# EAGLE design FX3_Explorer_Breakout_RevC (EAGLE 8.3.1)
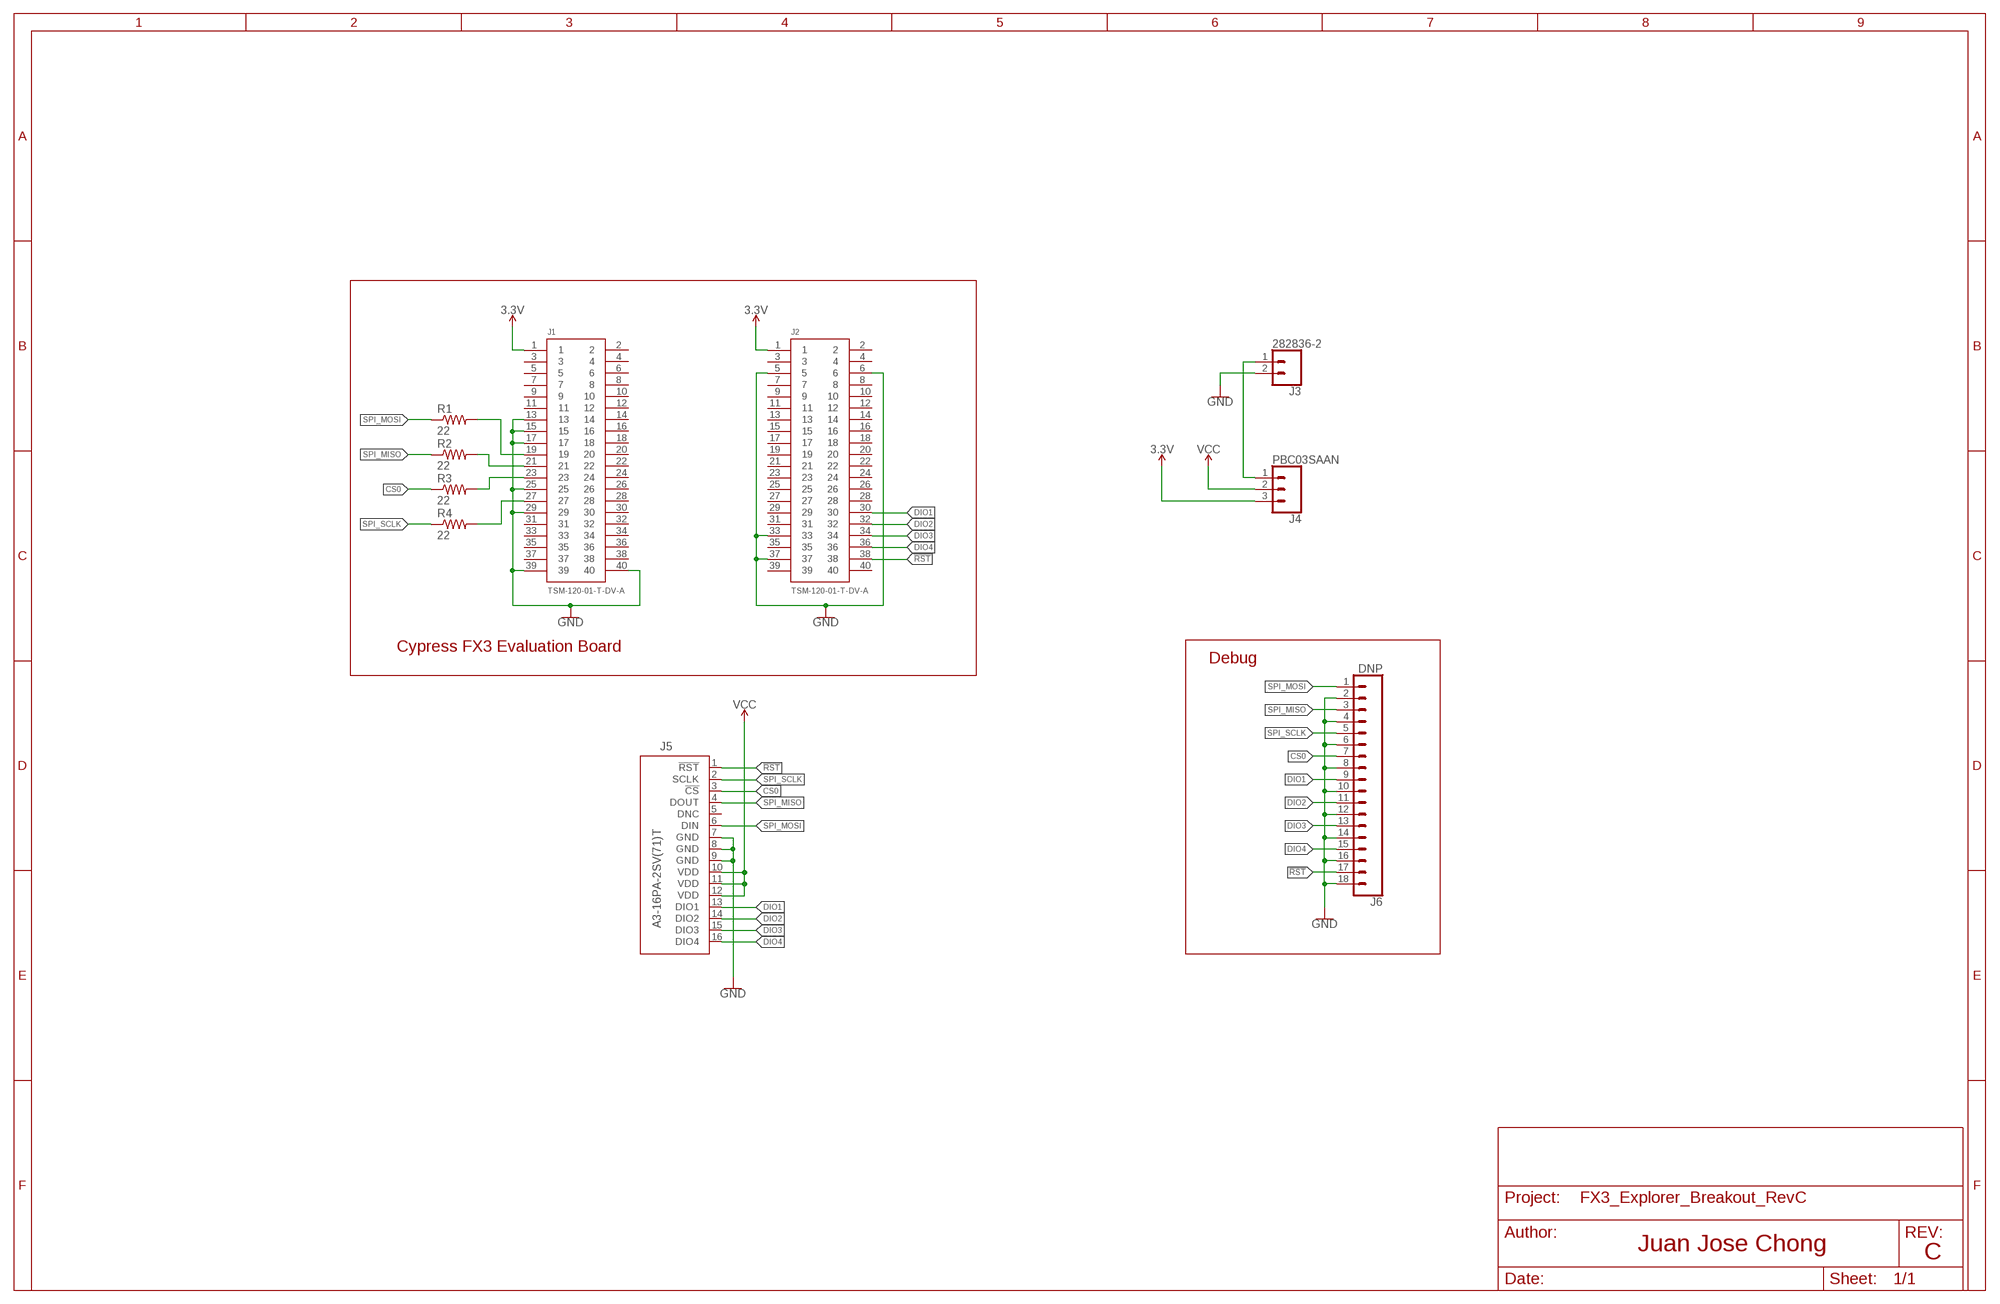
[diagram p0: schematic, sheet 1]

## Parts
J1  TSM-120-01-T-DV-A  TSM-120-XX-XXX-DV  [TSM-120-XX-XXX-D]
J2  TSM-120-01-T-DV-A  TSM-120-XX-XXX-DV  [TSM-120-XX-XXX-D]
J3  282836-2  CONN_025MM  [SCREWTERMINAL-5MM-2]
J4  PBC03SAAN  CONN_03  [1X03]
J5  A3-16PA-2SV(71)T  [A3-16PA-2SV(71)-TOP]
J6  DNP  CONN_18SILK  [1X18]
R1  22  R-US_R0603  [R0603]
R2  22  R-US_R0603  [R0603]
R3  22  R-US_R0603  [R0603]
R4  22  R-US_R0603  [R0603]

## Nets
3.3V: J1.1 J2.1 J4.3
!RST: J2.38 J5.1(!RST) J6.17
CS0: J5.3(!CS) J6.7 R3.1
DIO1: J2.30 J5.13(DIO1) J6.9
DIO2: J2.32 J5.14(DIO2) J6.11
DIO3: J2.34 J5.15(DIO3) J6.13
DIO4: J2.36 J5.16(DIO4) J6.15
GND: J1.13 J1.15 J1.17 J1.25 J1.29 J1.39 J1.40 J2.5 J2.6 J2.33 J2.37 J3.2 J5.7(GND) J5.8(GND) J5.9(GND) J6.2 J6.4 J6.6 J6.8 J6.10 J6.12 J6.14 J6.16 J6.18
N$1: J1.19 R1.2
N$2: J1.21 R2.2
N$3: J1.23 R3.2
N$4: J1.27 R4.2
N$6: J3.1 J4.1
SPI_MISO: J5.4(DOUT) J6.3 R2.1
SPI_MOSI: J5.6(DIN) J6.1 R1.1
SPI_SCLK: J5.2(SCLK) J6.5 R4.1
VCC: J4.2 J5.10(VDD) J5.11(VDD) J5.12(VDD)
Unconnected: J1.2 J1.3 J1.4 J1.5 J1.6 J1.7 J1.8 J1.9 J1.10 J1.11 J1.12 J1.14 J1.16 J1.18 J1.20 J1.22 J1.24 J1.26 J1.28 J1.30 J1.31 J1.32 J1.33 J1.34 J1.35 J1.36 J1.37 J1.38 J2.2 J2.3 J2.4 J2.7 J2.8 J2.9 J2.10 J2.11 J2.12 J2.13 J2.14 J2.15 J2.16 J2.17 J2.18 J2.19 J2.20 J2.21 J2.22 J2.23 J2.24 J2.25 J2.26 J2.27 J2.28 J2.29 J2.31 J2.35 J2.39 J2.40 J5.5(DNC)

## Notes on the sheet
- Cypress FX3 Evaluation Board
- Debug
- C

## Library data of the parts
J1 J2 = TSM-120-XX-XXX-DV:TSM-120-XX-XXX-DV: .100" (2,54mm) Surface Mount, Double Row, Vertical Mount. manufacturer:SAMTEC; PARTNO: TSM-120-01-T-DV-A
J3 = SparkFun-Connectors:CONN_02: Multi connection point. Often used as Generic Header-pin footprint for 0.1 inch spaced/style header connections On any of the 0.1 inch spaced packages, you can populate with these: Break Away Headers - Straight <https://www.sparkfun.com/products/116> (PRT-00116) Break Away Male Headers - Right Angle <https://www.sparkfun.com/products/553> (PRT-00553) Female Headers <https://www.sparkfun.com/products/115> (PRT-00115) Break Away Headers - Machine Pin <https://www.sparkfun.com/products/117> (PRT-00117) Break Away Female Headers - Swiss Machine Pin <https://www.sparkfun.com/products/743> (PRT-00743) For SCREWTERMINALS and SPRING TERMINALS visit here: Screw Terimnals on SparkFun.com <https://www.sparkfun.com/search/results?term=Screw+Terminals> (5mm/3.5mm/2.54mm spacing) This device is also useful as a general connection point to wire up your design to another part of your project. Our various solder wires solder well into these plated through hole pads. Hook-Up Wire - Assortment (Stranded, 22 AWG) <https://www.sparkfun.com/products/11375> (PRT-11375) Hook-Up Wire - Assortment (Solid Core, 22 AWG) <https://www.sparkfun.com/products/11367> (PRT-11367) View the entire wire category on our website here <https://www.sparkfun.com/categories/141> Special notes: Molex polarized connector foot print use with: PRT-08233 with associated crimp pins and housings. 2.54_SCREWTERM for use with PRT-10571. 3.5mm Screw Terminal footprints for PRT-08084 5mm Screw Terminal footprints for use with PRT-08432; PARTNO: 282836-2; SF_SKU: PRT-08432
J4 = SparkFun-Connectors:CONN_03: Multi connection point. Often used as Generic Header-pin footprint for 0.1 inch spaced/style header connections On any of the 0.1 inch spaced packages, you can populate with these: Break Away Headers - Straight <https://www.sparkfun.com/products/116> (PRT-00116) Break Away Male Headers - Right Angle <https://www.sparkfun.com/products/553> (PRT-00553) Female Headers <https://www.sparkfun.com/products/115> (PRT-00115) Break Away Headers - Machine Pin <https://www.sparkfun.com/products/117> (PRT-00117) Break Away Female Headers - Swiss Machine Pin <https://www.sparkfun.com/products/743> (PRT-00743) Stackable Header - 3 Pin (Female, 0.1") <https://www.sparkfun.com/products/13875> (PRT-13875) For SCREWTERMINALS and SPRING TERMINALS visit here: Screw Terimnals on SparkFun.com <https://www.sparkfun.com/search/results?term=Screw+Terminals> (5mm/3.5mm/2.54mm spacing) This device is also useful as a general connection point to wire up your design to another part of your project. Our various solder wires solder well into these plated through hole pads. Hook-Up Wire - Assortment (Stranded, 22 AWG) <https://www.sparkfun.com/products/11375> (PRT-11375) Hook-Up Wire - Assortment (Solid Core, 22 AWG) <https://www.sparkfun.com/products/11367> (PRT-11367) View the entire wire category on our website here <https://www.sparkfun.com/categories/141> Special notes: Molex polarized connector foot print use with SKU : PRT-08232 with associated crimp pins and housings.; PARTNO: PBC03SAAN
J5 = Analog Devices iSensors:A3-16PA-2SV(71); PARTNO: A3-16PA-2SV(71)
J6 = SparkFun-Connectors:CONN_18: Multi connection point. Often used as Generic Header-pin footprint for 0.1 inch spaced/style header connections On any of the 0.1 inch spaced packages, you can populate with these: Break Away Headers - Straight <https://www.sparkfun.com/products/116> (PRT-00116) Break Away Male Headers - Right Angle <https://www.sparkfun.com/products/553> (PRT-00553) Female Headers <https://www.sparkfun.com/products/115> (PRT-00115) Break Away Headers - Machine Pin <https://www.sparkfun.com/products/117> (PRT-00117) Break Away Female Headers - Swiss Machine Pin <https://www.sparkfun.com/products/743> (PRT-00743) For SCREWTERMINALS and SPRING TERMINALS visit here: Screw Terimnals on SparkFun.com <https://www.sparkfun.com/search/results?term=Screw+Terminals> (5mm/3.5mm/2.54mm spacing) This device is also useful as a general connection point to wire up your design to another part of your project. Our various solder wires solder well into these plated through hole pads. Hook-Up Wire - Assortment (Stranded, 22 AWG) <https://www.sparkfun.com/products/11375> (PRT-11375) Hook-Up Wire - Assortment (Solid Core, 22 AWG) <https://www.sparkfun.com/products/11367> (PRT-11367) View the entire wire category on our website here <https://www.sparkfun.com/categories/141> Special notes: Molex polarized connector foot print use with SKU : PRT-08231 with associated crimp pins and housings. 1MM SMD Version SKU: PRT-10208 NOTES ON THE VARIANTS LOCK and LOCK_LONGPADS... This footprint was designed to help hold the alignment of a through-hole component (i.e. 6-pin header) while soldering it into place. You may notice that each hole has been shifted either up or down by 0.005 of an inch from it's more standard position (which is a perfectly straight line). This slight alteration caused the pins (the squares in the middle) to touch the edges of the holes. Because they are alternating, it causes a "brace" to hold the component in place. 0.005 has proven to be the perfect amount of "off-center" position when using our standard breakaway headers. Although looks a little odd when you look at the bare footprint, once you have a header in there, the alteration is very hard to notice. Also,if you push a header all the way into place, it is covered up entirely on the bottom side.
R1-R4 = adafruit:R-US_: RESISTOR, American symbol; PARTNO: RC0603FR-0722RL

## Board
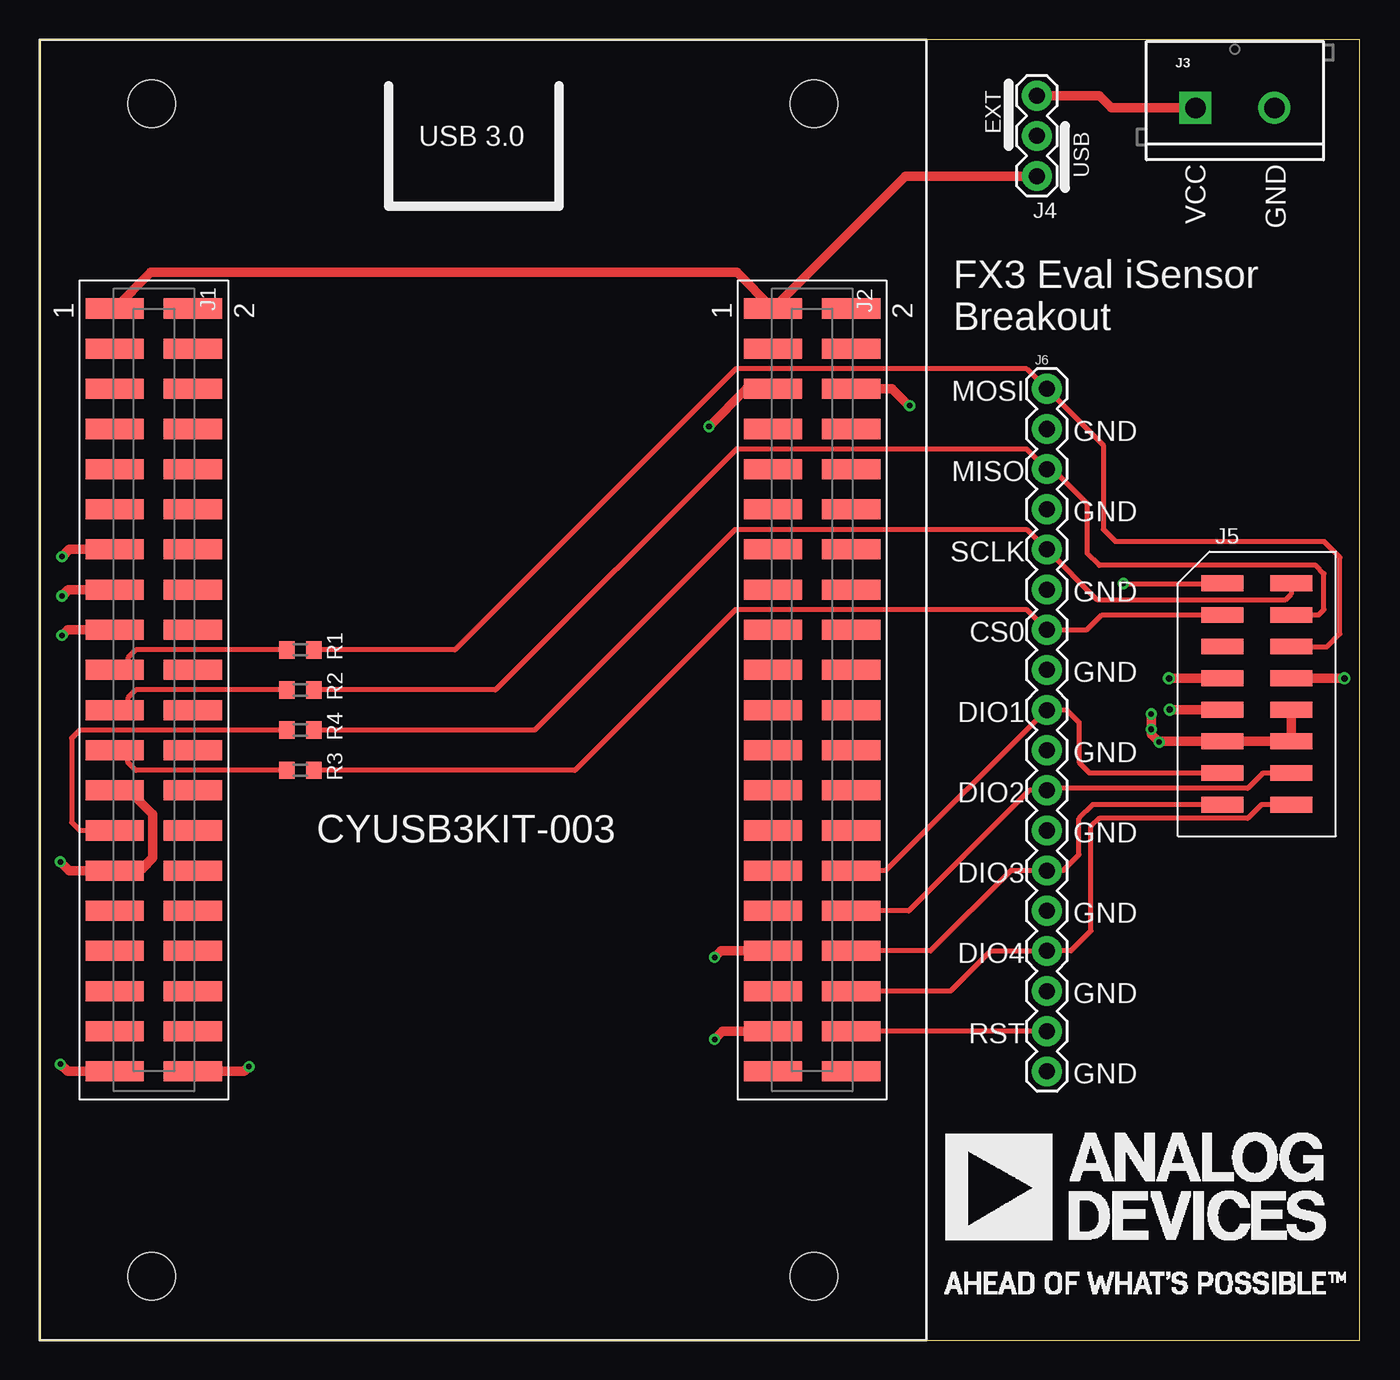
[diagram p1: board, top side]
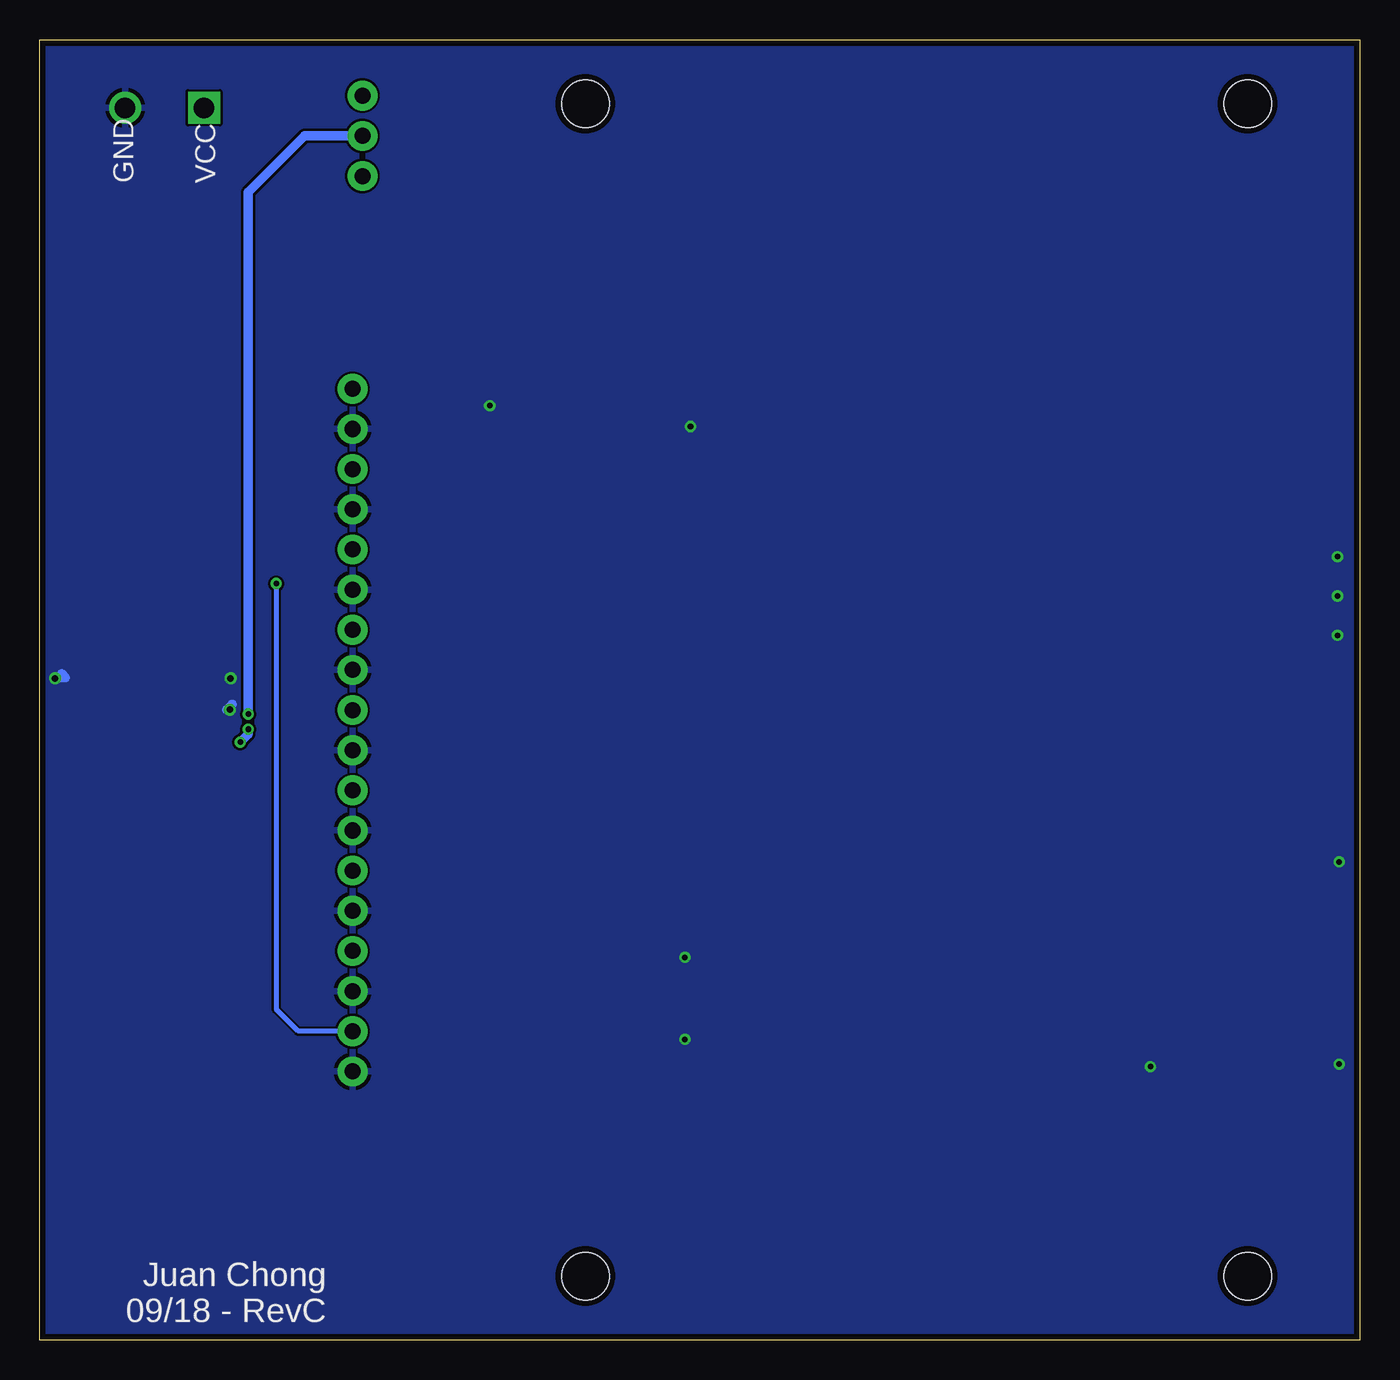
[diagram p2: board, bottom side, seen from below]

Size 83.57 x 82.3 mm. Coordinates in mm from the lower left corner, seen from the top.
Outline: 0,0 83.57,0 83.57,82.3 0,82.3 0,0
Copper layers (1*16): Top 0.0356mm / dielectric 1.5011mm / Bottom 0.0356mm
Design rules "LaenPCBOrder_FilledVias": minimum track width 6mil, minimum drill 10mil, track to track 6mil, track to pad 6mil, pad to pad 6mil, via to via 6mil, smd to smd 6mil, copper to edge 15mil, drill to drill 6mil, minimum pad ring 7mil, minimum via ring 7mil, stop-mask expansion 4mil, vias tented up to drill 12mil, thermal gap 10mil
Holes 3 mm at 49.02,78.23 7.11,78.23 49.02,4.06 7.11,4.06

### Footprints (pad centres in the part's own frame; a part is rotated, then mirrored left to right if it is on the bottom)
TSM-120-XX-XXX-D = smd 1.27 x 3.683: 1 0,-1.206; 2 0,3.747; 3 2.54,-1.206; 4 2.54,3.747; 5 5.08,-1.206; 6 5.08,3.747; 7 7.62,-1.206; 8 7.62,3.747; 9 10.16,-1.206; 10 10.16,3.747; 11 12.7,-1.206; 12 12.7,3.747; 13 15.24,-1.206; 14 15.24,3.747; 15 17.78,-1.206; 16 17.78,3.747; 17 20.32,-1.206; 18 20.32,3.747; 19 22.86,-1.206; 20 22.86,3.747; 21 25.4,-1.206; 22 25.4,3.747; 23 27.94,-1.206; 24 27.94,3.747; 25 30.48,-1.206; 26 30.48,3.747; 27 33.02,-1.206; 28 33.02,3.747; 29 35.56,-1.206; 30 35.56,3.747; 31 38.1,-1.206; 32 38.1,3.747; 33 40.64,-1.206; 34 40.64,3.747; 35 43.18,-1.206; 36 43.18,3.747; 37 45.72,-1.206; 38 45.72,3.747; 39 48.26,-1.206; 40 48.26,3.747
SCREWTERMINAL-5MM-2 = drill 1.3 pad 2.032 square: 1 0,0 | drill 1.3 pad 2.032: 2 5,0
1X03 = drill 1.016 pad 1.88: 1 0,0; 2 2.54,0; 3 5.08,0
A3-16PA-2SV(71)-TOP = smd 1 x 2.65: 1 -7,-2.225; 2 -7,2.125; 3 -5,-2.225; 4 -5,2.125; 5 -3,-2.225; 6 -3,2.125; 7 -1,-2.225; 8 -1,2.125; 9 1,-2.225; 10 1,2.125; 11 3,-2.225; 12 3,2.125; 13 5,-2.225; 14 5,2.125; 15 7,-2.225; 16 7,2.125
1X18 = drill 1.016 pad 1.88: 1 0,0; 2 2.54,0; 3 5.08,0; 4 7.62,0; 5 10.16,0; 6 12.7,0; 7 15.24,0; 8 17.78,0; 9 20.32,0; 10 22.86,0; 11 25.4,0; 12 27.94,0; 13 30.48,0; 14 33.02,0; 15 35.56,0; 16 38.1,0; 17 40.64,0; 18 43.18,0
R0603 = smd 1 x 1.1: 1 -0.85,0; 2 0.85,0

### Placement (x,y rotation side)
DRILEGEND  [DRILEGEND]  114.15,16.27 0 top  (outside the outline)
J1  5.97,65.28 270 top
J2  47.62,65.28 270 top
J3  73.15,77.98 0 top
J4  63.12,78.74 270 top
J5  77.09,40.89 270 top
J6  63.75,60.2 270 top
R1  16.51,43.69 180 top
R2  16.51,41.15 180 top
R3  16.51,36.07 180 top
R4  16.51,38.61 180 top

### Tracks (layer width: path | path; a pad name or v marks a point on that pad's centre or on a via)
3.3V
  Top 0.61: J4.3 54.8,73.66 J2.1 44.13,67.56 7.05,67.56 J1.1
!RST  (via drill 0.35)
  Top 0.305: J6.17 J2.38 | v68.58,47.88 74.85,47.88 J5.1
  Bottom 0.305: v68.58,47.88 68.58,20.95 67.18,19.56 J6.17
CS0
  Top 0.305: J5.3 67.23,45.89 66.29,44.96 J6.7 62.48,46.23 44.04,46.23 33.88,36.07 R3.1
DIO1
  Top 0.305: J5.13 66.47,35.89 65.79,36.58 65.79,39.12 65.02,39.88 J6.9 63.7,39.88 53.54,29.72 J2.30
DIO2
  Top 0.305: J5.14 77.42,35.89 76.45,34.92 63.88,34.92 J6.11 62.64,34.8 55.02,27.18 J2.32
DIO3
  Top 0.305: J5.15 66.66,33.89 65.79,33.02 65.79,30.73 64.77,29.72 J6.13 61.47,29.72 56.39,24.64 J2.34
DIO4
  Top 0.305: J5.16 77.33,33.89 76.45,33.02 67.06,33.02 66.55,32.51 66.55,25.91 65.28,24.64 J6.15 60.2,24.64 57.66,22.1 J2.36
GND  (via drill 0.35, 0.41)
  Top 0.61: J5.8 81.93,41.89 v82.58,41.88 | J5.7 72.12,41.89 v71.48,41.88 | J5.9 72.17,39.89 v71.53,39.9 | J1.40 12.95,17.02 v13.26,17.32 | J1.39 1.78,17.02 v1.32,17.48 | v1.32,30.28 1.88,29.72 J1.29 4.86,29.82 6.45,29.82 7.16,30.53 7.16,33.27 5.64,34.8 J1.25 | J2.33 43.13,24.64 v42.72,24.23 | J2.37 43.23,19.56 v42.72,19.05 | J2.5 44.76,60.2 v42.37,57.81 | J2.6 53.95,60.2 55.02,59.13 v55.07,59.13 | J1.13 1.88,50.04 v1.42,49.58 | J1.15 1.83,47.5 v1.42,47.09 | J1.17 1.78,44.96 v1.42,44.6
  Bottom 0.61: v82.58,41.88 81.94,41.94 82.17,42.16 | v71.48,41.88 71.45,41.88 | v71.53,39.9 71.73,39.9 71.37,40.26
  pour Bottom: -3.56,-1.91 107.06,-2.03 106.81,84.33 -3.68,84.33
N$1
  Top 0.305: R1.2 6.1,43.69 5.59,43.18 5.59,42.93 5.84,42.67 5.02,42.67 J1.19
N$2
  Top 0.305: R2.2 6.1,41.15 5.59,40.64 5.59,40.13 5.02,40.13 J1.21
N$3
  Top 0.305: R3.2 6.1,36.07 5.59,36.58 5.59,37.08 5.02,37.08 J1.23
N$4
  Top 0.305: R4.2 2.54,38.61 2.03,38.1 2.03,32.77 2.54,32.26 J1.27 | J1.27 5.33,32.26 J1.27
N$6
  Top 0.61: J3.1 67.82,77.98 67.06,78.74 J4.1
SPI_MISO
  Top 0.305: J5.4 80.95,45.89 81.28,46.23 81.28,48.51 80.77,49.02 67.06,49.02 66.29,49.78 66.29,52.96 64.14,55.12 J6.3 62.48,56.39 44.1,56.39 28.86,41.15 R2.1
SPI_MOSI
  Top 0.305: J5.6 81.49,43.89 82.3,44.7 82.3,49.53 81.28,50.55 68.07,50.55 67.31,51.31 67.31,56.64 J6.1 62.48,61.47 44.07,61.47 26.29,43.69 R1.1
SPI_SCLK
  Top 0.305: J5.2 79.21,47.21 78.87,46.86 66.93,46.86 J6.5 62.48,51.31 44.04,51.31 31.34,38.61 R4.1
VCC  (via drill 0.35)
  Top 0.61: J5.10 J5.12 J5.11 70.91,37.89 v70.87,37.85 | 71.63,37.89 70.82,37.89 70.36,38.35 v70.36,38.66 v70.36,39.62
  Bottom 0.61: J4.2 66.8,76.2 70.36,72.64 v70.36,39.62 | v70.36,38.66 70.36,38.35 v70.87,37.85

### Text on the board
tNames: USB 3.0 | EXT | USB | VCC | GND | FX3 Eval iSensor / Breakout | MOSI | GND | MISO | GND | SCLK | GND | CS0 | GND | DIO1 | GND | DIO2 | CYUSB3KIT-003 | GND | DIO3 | GND | DIO4 | GND | RST | GND
bNames: VCC | GND | Juan Chong / 09/18 - RevC
Document: 1. This drawing is CAD generated. No manual changes authorized after release. / 2. All printed wiring boards to be manufactured in accordance with IPC-610 Class 2. / In case of conflict this drawing governs all other specifications. / 3. Material, copper sheet laminate, copper clad FR4 170Tg. Interior / layers (if applicable) to be 0.5oz copper. Exterior layers to be 1oz copper finished. / Final thickness to be 0.063" (1.6mm). / 4. All holes are plated through holes unless noted otherwise. Minimum plated through holes / to have 25um thick walls. / 5. All finished trace widths to be +/- 20% measured at the bottom, minimum finished / spacing to be 100um. / 6. All exposed copper to be finished with ENIG Solder finish over clean bare copper. / 7. Drill boards using drill data, drill patterns, and drill table provided. Hole locations / shall be 0.003" (0.075mm) about true position (radial error). All finished holes to be +/-0.003" (0.075mm) / diameter unless noted otherwise. All finished vias to be +/-0.003" (0.075mm) to closed diameter. / 8. Minimum annular ring to be 50um external layers and 25um internal layers (if applicable). / 9. Layer to layer misalignment shall not exceed 75um (radial error) about true position. / 10. Solder mask construction to be SMOBC using green LPI solder mask material. Solder mask / to be 18 ~ 50um thick after curing, both sides. / 11. Solder mask misalignment shall not exceed 0.003" (0.075mm). Solder mask may overlap through hole / solder pads by 0.001" (0.025mm) maximum, but shall not overlap SMT pads. / 12. Silkscreen should be applied over solder mask using a white epoxy-based ink. The silkscreen / should not overlap solder pads unless noted otherwise. / 13. Dimensions shown reflect the board size after plating. / 14. The circuit board manufacturer shall apply a name and date code on the bottom side / of the board in copper etch.
DrillLegend: LAYER-STACK
DrillLegend_01-16: 01-16
DrillLegend_01-20: 01-20